# Altium schematic sheet medusa-ai-sensors.SchDoc
size Legal; SheetNumber: 5; SheetTotal: 5
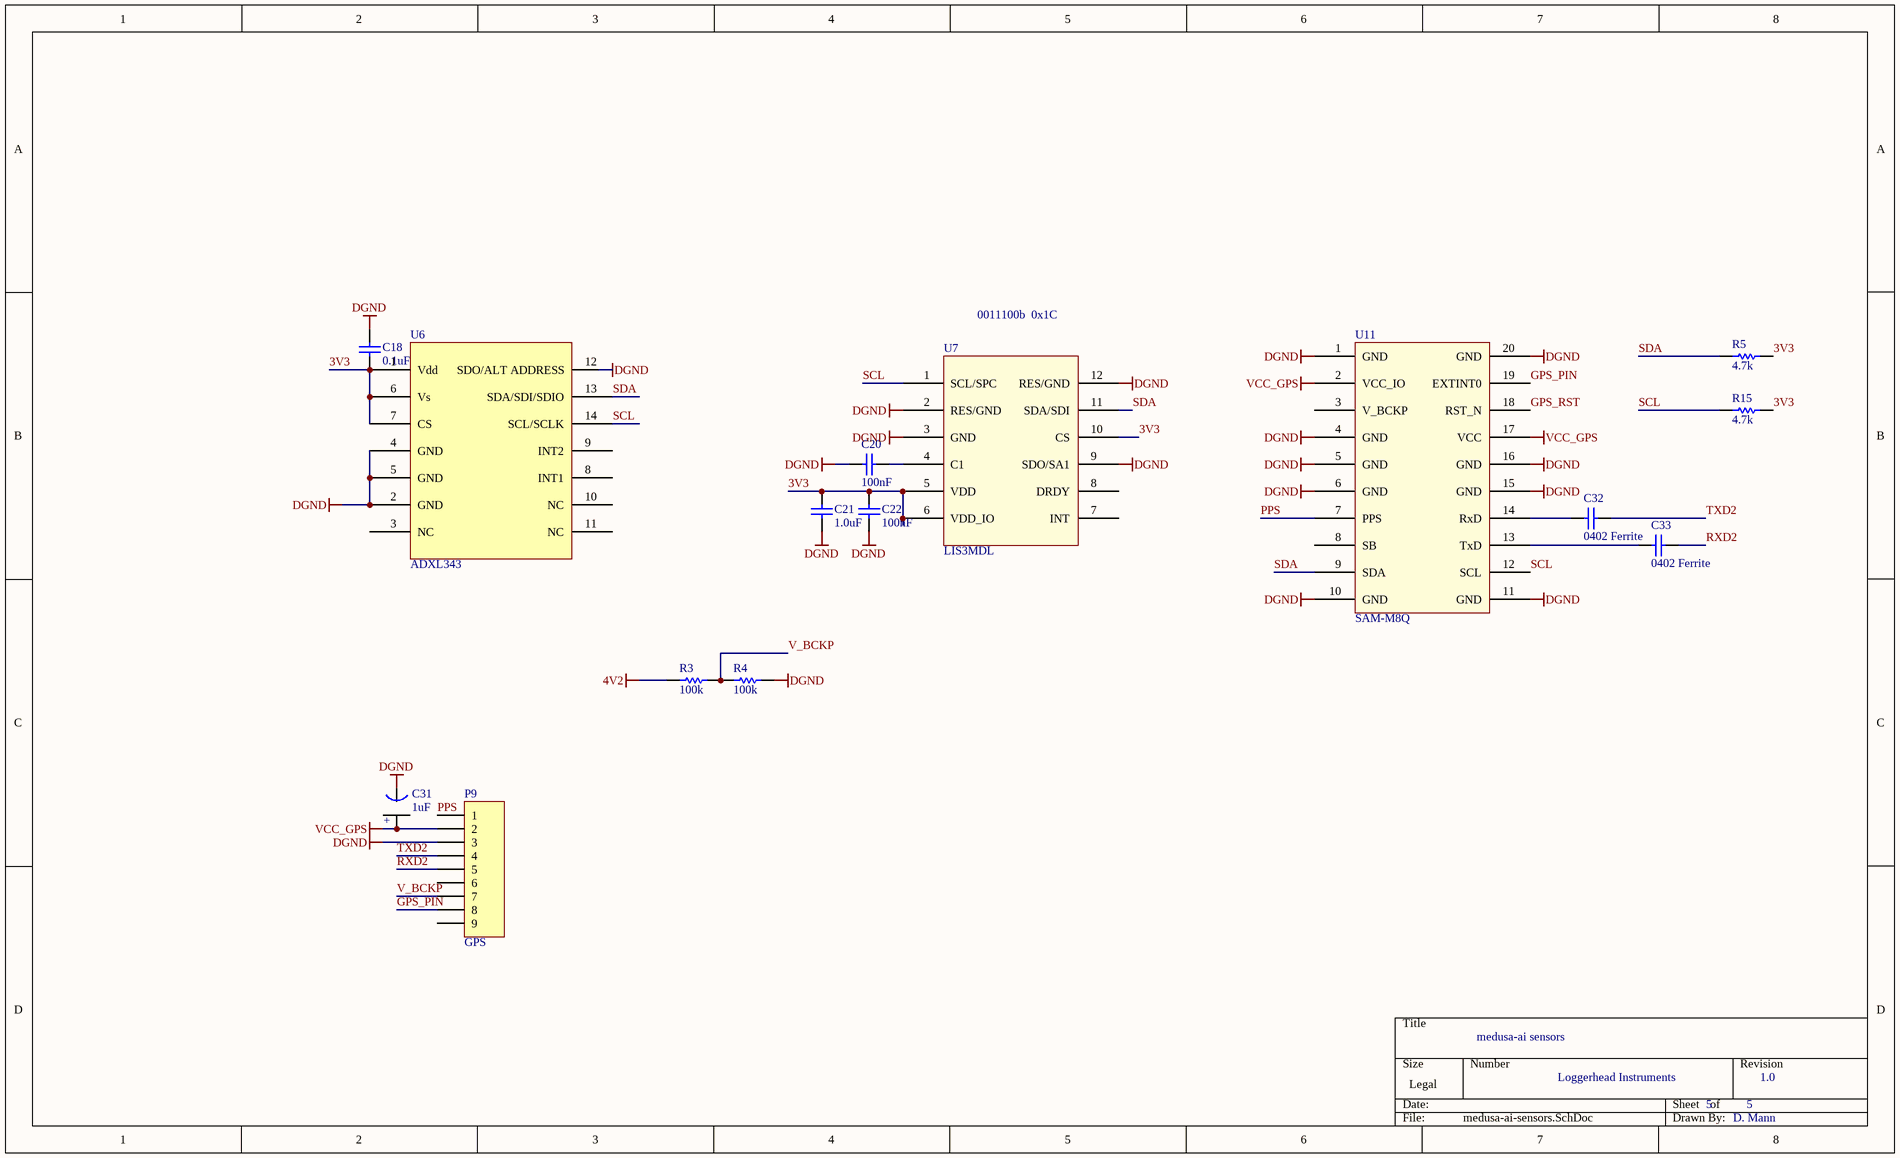
[diagram p0: medusa-ai-sensors.SchDoc]

## Parts
C18  0.1uF  [0402]
C20  100nF  [0402]
C21  1.0uF  [0402]
C22  100nF  [0402]
C31  1uF  [Tant0805]
C32  0402 Ferrite  [0402]
C33  0402 Ferrite  [0402]
P9  GPS  [HDR1X9]
R3  100k  [3-0603]
R4  100k  [3-0603]
R5  4.7k  [3-0603]
R15  4.7k  [3-0603]
U6  ADXL343  [ADXL345]
U7  LIS3MDL  [LGA-12]
U11  SAM-M8Q  [GPS SAM-MQ8]

## Nets
4V2: R3.2
DGND: C18.2 C20.1 C21.2 C22.2 C31.1(GND) P9.3 R4.1 U6.2(GND) U6.4(GND) U6.5(GND) U6.12(SDO/ALT_ADDRESS) U7.2(RES/GND) U7.3(GND) U7.9(SDO/SA1) U7.12(RES/GND) U11.1(GND) U11.4(GND) U11.5(GND) U11.6(GND) U11.10(GND) U11.11(GND) U11.15(GND) U11.16(GND) U11.20(GND)
VCC_GPS: C31.2(+) P9.2 U11.2(VCC_IO) U11.17(VCC)
3V3: C18.1 C21.1 C22.1 R5.2 R15.2 U6.1(Vdd) U6.6(Vs) U6.7(CS) U7.5(VDD) U7.6(VDD_IO) U7.10(CS)
GPS_PIN: P9.8 U11.19(EXTINT0)
GPS_RST: U11.18(RST_N)
PPS: P9.1 U11.7(PPS)
RXD2: C33.2 P9.5
SCL: R15.1 U6.14(SCL/SCLK) U7.1(SCL/SPC) U11.12(SCL)
SDA: R5.1 U6.13(SDA/SDI/SDIO) U7.11(SDA/SDI) U11.9(SDA)
TXD2: C32.2 P9.4
V_BCKP: P9.7 R3.1 R4.2
NetC20_2: C20.2 U7.4(C1)
NetC32_1: C32.1 U11.14(RxD)
NetC33_1: C33.1 U11.13(TxD)

Not connected (* = marked no-connect by the designer): P9 6 9; U6 3(NC) 8(INT1) 9(INT2) 10(NC) 11(NC); U7 7(INT) 8(DRDY); U11 3(V_BCKP) 8(SB)

## Notes on the sheet
- 0011100b  0x1C
- medusa-ai sensors
- Loggerhead Instruments
- 5
- 1.0
- D. Mann

## Library data of the parts
C18 C21 = C0402: Ceramic Chip Capacitor - Standard; Note: Footprint corresponds to dimensions for bulk cassette packaging. This case size has tightened tolerances.; Published: 17-Jul-2002; LatestRevisionDate: 19-Mar-2004; LatestRevisionNote: Silkscreen size reduced.; DatasheetDocument: Mar-2001; PackageDocument: Mar-2001; PackageReference: 0402; Publisher: Altium Limited; Code_JEITA: 0402; Code_IPC: 1005 [0402]; ComponentLink1Description: Manufacturer Link; ComponentLink1URL: http://www.kemet.com/; ComponentLink2Description: Datasheet; ComponentLink2URL: http://www.kemet.com/kemet/web/homepage/kechome.nsf/vapubfilesname/F3102TA.pdf/$file/F3102TA.pdf
  C18: Value: 0.1uF
  C21: Value: 1.0uF
C20 C22 = C0402: Ceramic Chip Capacitor - Standard; Note: Footprint corresponds to dimensions for bulk cassette packaging. This case size has tightened tolerances.; Value: 1.0uF; Published: 17-Jul-2002; LatestRevisionDate: 19-Mar-2004; LatestRevisionNote: Silkscreen size reduced.; DatasheetDocument: Mar-2001; PackageDocument: Mar-2001; PackageReference: 0402; Publisher: Altium Limited; Code_JEITA: 0402; Code_IPC: 1005 [0402]; ComponentLink1Description: Manufacturer Link; ComponentLink1URL: http://www.kemet.com/; ComponentLink2Description: Datasheet; ComponentLink2URL: http://www.kemet.com/kemet/web/homepage/kechome.nsf/vapubfilesname/F3102TA.pdf/$file/F3102TA.pdf
C31 = Tant0805: Value: 1uF
C32 C33 = C0402: Ceramic Chip Capacitor - Standard; Note: Footprint corresponds to dimensions for bulk cassette packaging. This case size has tightened tolerances.; Value: 100pF; Published: 17-Jul-2002; LatestRevisionDate: 19-Mar-2004; LatestRevisionNote: Silkscreen size reduced.; DatasheetDocument: Mar-2001; PackageDocument: Mar-2001; PackageReference: 0402; Publisher: Altium Limited; Code_JEITA: 0402; Code_IPC: 1005 [0402]; ComponentLink1Description: Manufacturer Link; ComponentLink1URL: http://www.kemet.com/; ComponentLink2Description: Datasheet; ComponentLink2URL: http://www.kemet.com/kemet/web/homepage/kechome.nsf/vapubfilesname/F3102TA.pdf/$file/F3102TA.pdf
P9 = Header 9: Header, 9-Pin; LatestRevisionDate: 17-Jul-2002; LatestRevisionNote: Re-released for DXP Platform.; Publisher: Altium Limited
R3-R5 R15 = ERJ3RK: Precision Thick Film Chip Resistor, 10 Ohm to 1M Ohm Range, 1% and 0.5% Tolerance, 0603 Size, 0.063 W; Published: 17-Dec-2003; LatestRevisionDate: 19-Mar-2004; LatestRevisionNote: Silkscreen size reduced.; PackageDocument: Mar-2003; PackageReference: 3-0603; Publisher: Altium Limited; Code_IPC: 1608 [0603]; ComponentLink1Description: Manufacturer Link; ComponentLink1URL: http://www.panasonic.com/industrial/components/resistive_products.htm; ComponentLink2Description: Datasheet; ComponentLink2URL: http://www.panasonic.com/industrial/components/pdf/AOA0000CE2.pdf
U6 = ADXL345
U7 = LIS3MDL: magnetometer
U11 = GPS SAM-M8Q